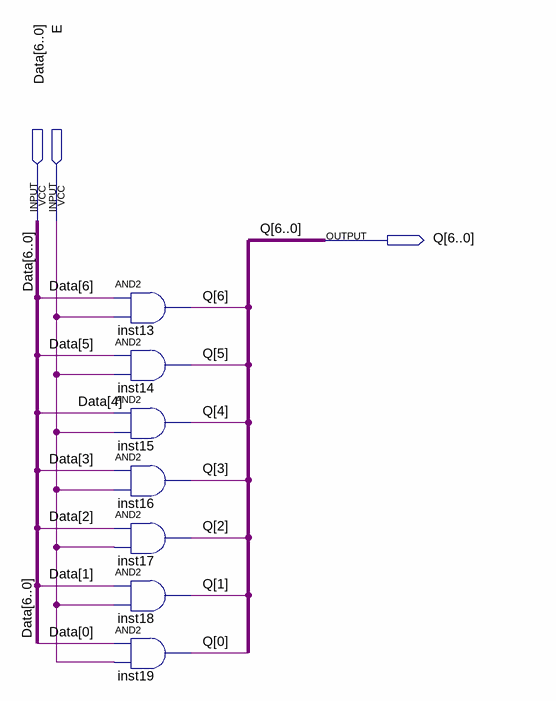
[diagram p0: schematic sheet]
// Quartus schematic BusEnable7.bdf as structural Verilog: 7 symbols, 3 pins
module BusEnable7 (
  input  [6:0] Data,
  input  E,
  output [6:0] Q
);

  and inst13 (Q[6], Data[6], E);
  and inst14 (Q[5], Data[5], E);
  and inst15 (Q[4], Data[4], E);
  and inst16 (Q[3], Data[3], E);
  and inst17 (Q[2], Data[2], E);
  and inst18 (Q[1], Data[1], E);
  and inst19 (Q[0], Data[0], E);
endmodule
